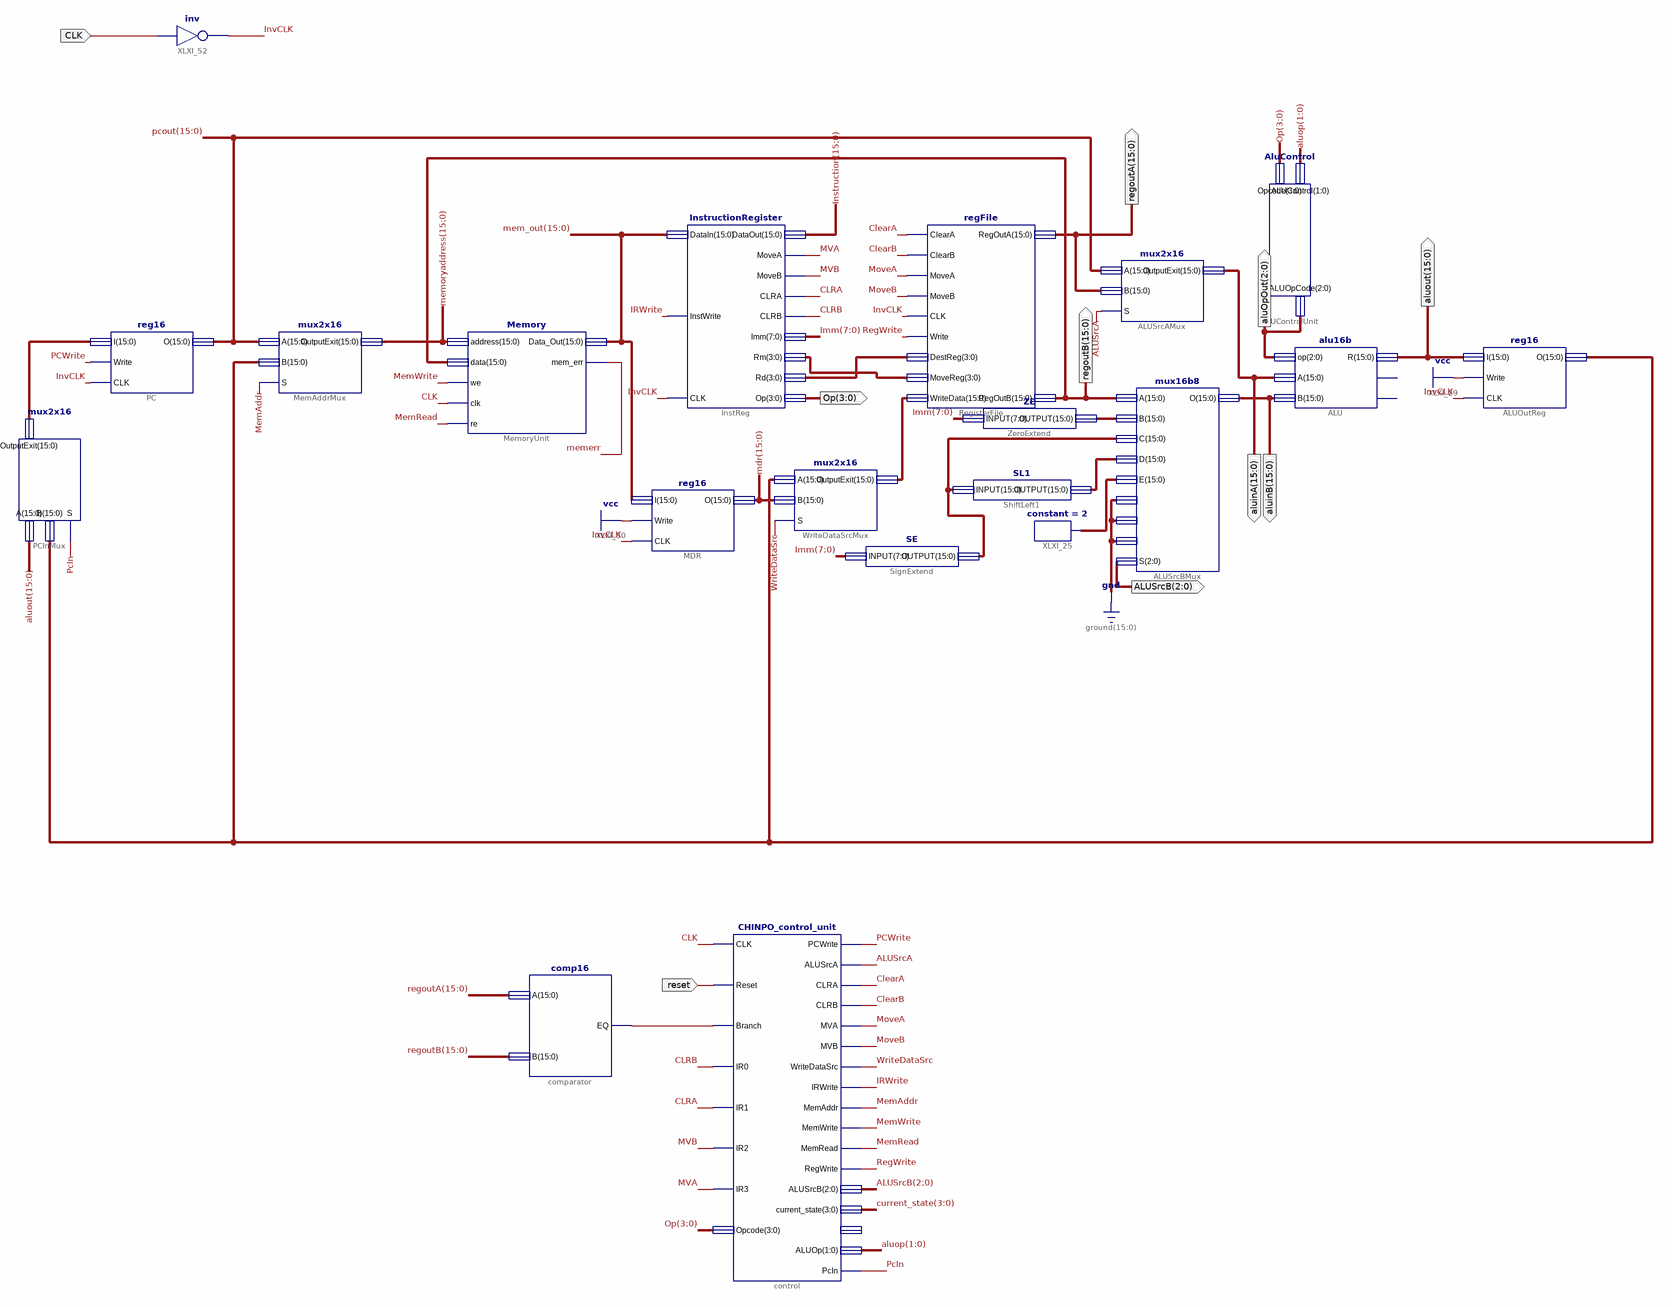
[diagram p0: schematic sheet 1]
// Xilinx ISE schematic Datapath.sch (spartan3e) as structural Verilog: 20 symbols, 10 ports
module Datapath (
  input  CLK,
  input  reset,
  output [15:0] regoutA,
  output [15:0] regoutB,
  output [2:0] aluOpOut,
  output [15:0] aluout,
  output [2:0] ALUSrcB,
  output [3:0] Op,
  output [15:0] aluinA,
  output [15:0] aluinB
);

  wire ALUSrcA, ClearA, ClearB, CLRA, CLRB, InvCLK, IRWrite, MemAddr, memerr, MemRead, MemWrite, MoveA,
       MoveB, MVA, MVB, PcIn, PCWrite, RegWrite, WriteDataSrc, XLXN_79;
  wire [1:0] aluop;
  wire [3:0] current_state, XLXN_6, XLXN_7;
  wire [7:0] Imm;
  wire [15:0] Instruction, mdr, mem_out, memoryaddress, pcout, XLXN_9, XLXN_26, XLXN_32, XLXN_33, XLXN_36,
       XLXN_141, XLXN_144;

  reg16 PC (.I(XLXN_144), .Write(PCWrite), .CLK(InvCLK), .O(pcout));
  mux2x16 MemAddrMux (.A(pcout), .B(XLXN_141), .S(MemAddr), .OutputExit(memoryaddress));
  InstructionRegister InstReg (
    .DataIn(mem_out), .InstWrite(IRWrite), .CLK(InvCLK), .DataOut(Instruction), .MoveA(MVA), .MoveB(MVB),
    .CLRA(CLRA), .CLRB(CLRB), .Imm(Imm), .Rm(XLXN_7), .Rd(XLXN_6), .Op(Op));
  mux2x16 WriteDataSrcMux (.A(XLXN_141), .B(mdr), .S(WriteDataSrc), .OutputExit(XLXN_9));
  regFile RegisterFile (
    .ClearA(ClearA), .ClearB(ClearB), .MoveA(MoveA), .MoveB(MoveB), .CLK(InvCLK), .Write(RegWrite),
    .DestReg(XLXN_6), .MoveReg(XLXN_7), .WriteData(XLXN_9), .RegOutA(regoutA), .RegOutB(regoutB));
  reg16 u_MDR (.I(mem_out), .Write(1'b1), .CLK(InvCLK), .O(mdr));
  mux2x16 ALUSrcAMux (.A(pcout), .B(regoutA), .S(ALUSrcA), .OutputExit(aluinA));
  mux16b8 ALUSrcBMux (
    .A(regoutB), .B(XLXN_26), .C(XLXN_32), .D(XLXN_33), .E(XLXN_36), .F({16{1'b0}}), .G({16{1'b0}}),
    .H({16{1'b0}}), .S(ALUSrcB), .O(aluinB));
  ZE ZeroExtend (.INPUT(Imm), .OUTPUT(XLXN_26));
  SE SignExtend (.INPUT(Imm), .OUTPUT(XLXN_32));
  SL1 ShiftLeft1 (.INPUT(XLXN_32), .OUTPUT(XLXN_33));
  constant #(.CValue("2")) XLXI_25 (.O(XLXN_36));
  reg16 ALUOutReg (.I(aluout), .Write(1'b1), .CLK(InvCLK), .O(XLXN_141));
  CHINPO_control_unit control (
    .CLK(CLK), .Reset(reset), .Branch(XLXN_79), .IR0(CLRB), .IR1(CLRA), .IR2(MVB), .IR3(MVA), .Opcode(Op),
    .PCWrite(PCWrite), .ALUSrcA(ALUSrcA), .CLRA(ClearA), .CLRB(ClearB), .MVA(MoveA), .MVB(MoveB),
    .WriteDataSrc(WriteDataSrc), .IRWrite(IRWrite), .MemAddr(MemAddr), .MemWrite(MemWrite),
    .MemRead(MemRead), .RegWrite(RegWrite), .ALUSrcB(ALUSrcB), .current_state(current_state), .ALUOp(aluop),
    .PcIn(PcIn));  // open: next_state
  AluControl ALUControlUnit (.ALUControl(aluop), .Opcode(Op), .ALUOpCode(aluOpOut));
  alu16b ALU (.A(aluinA), .B(aluinB), .op(aluOpOut), .R(aluout));  // open: ovfl, zero
  Memory MemoryUnit (
    .address(memoryaddress), .clk(CLK), .data(regoutB), .Data_Out(mem_out), .mem_err(memerr), .re(MemRead),
    .we(MemWrite));
  not XLXI_52 (InvCLK, CLK);
  comp16 comparator (.A(regoutA), .B(regoutB), .EQ(XLXN_79));
  mux2x16 PCInMux (.A(aluout), .B(XLXN_141), .S(PcIn), .OutputExit(XLXN_144));
endmodule
